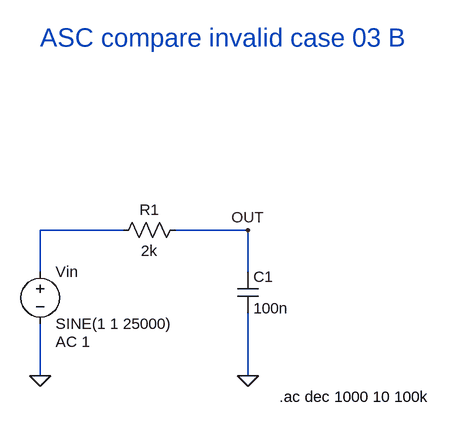
[diagram p0: schematic invalid_case_03_b.asc]
invalid_case_03_b.asc, the LTspice schematic file:
Version 4.1
SHEET 1 1164 680
WIRE 208 48 80 48
WIRE 400 48 288 48
WIRE 80 112 80 48
WIRE 400 112 400 48
WIRE 80 272 80 192
WIRE 400 272 400 176
FLAG 80 272 0
FLAG 400 272 0
FLAG 400 48 OUT
SYMBOL voltage 80 96 R0
WINDOW 123 24 124 Left 2
WINDOW 39 0 0 Left 2
SYMATTR Value2 AC 1
SYMATTR InstName Vin
SYMATTR Value SINE(1 1 25000)
SYMBOL res 304 32 R90
WINDOW 0 0 56 VBottom 2
WINDOW 3 32 56 VTop 2
SYMATTR InstName R1
SYMATTR Value 2k
SYMBOL cap 384 112 R0
SYMATTR InstName C1
SYMATTR Value 100n
TEXT 448 304 Left 2 !.ac dec 1000 10 100k
TEXT 80 -248 Left 4 ;ASC compare invalid case 03 B

The netlist it stands for:
* invalid_case_03_b.asc
Vin N001 0 SINE(1 1 25000) AC 1
R1 OUT N001 2k
C1 OUT 0 100n
.ac dec 1000 10 100k
* ASC compare invalid case 03 B
.backanno
.end